# EAGLE schematic untitled (EAGLE 9.6.1)
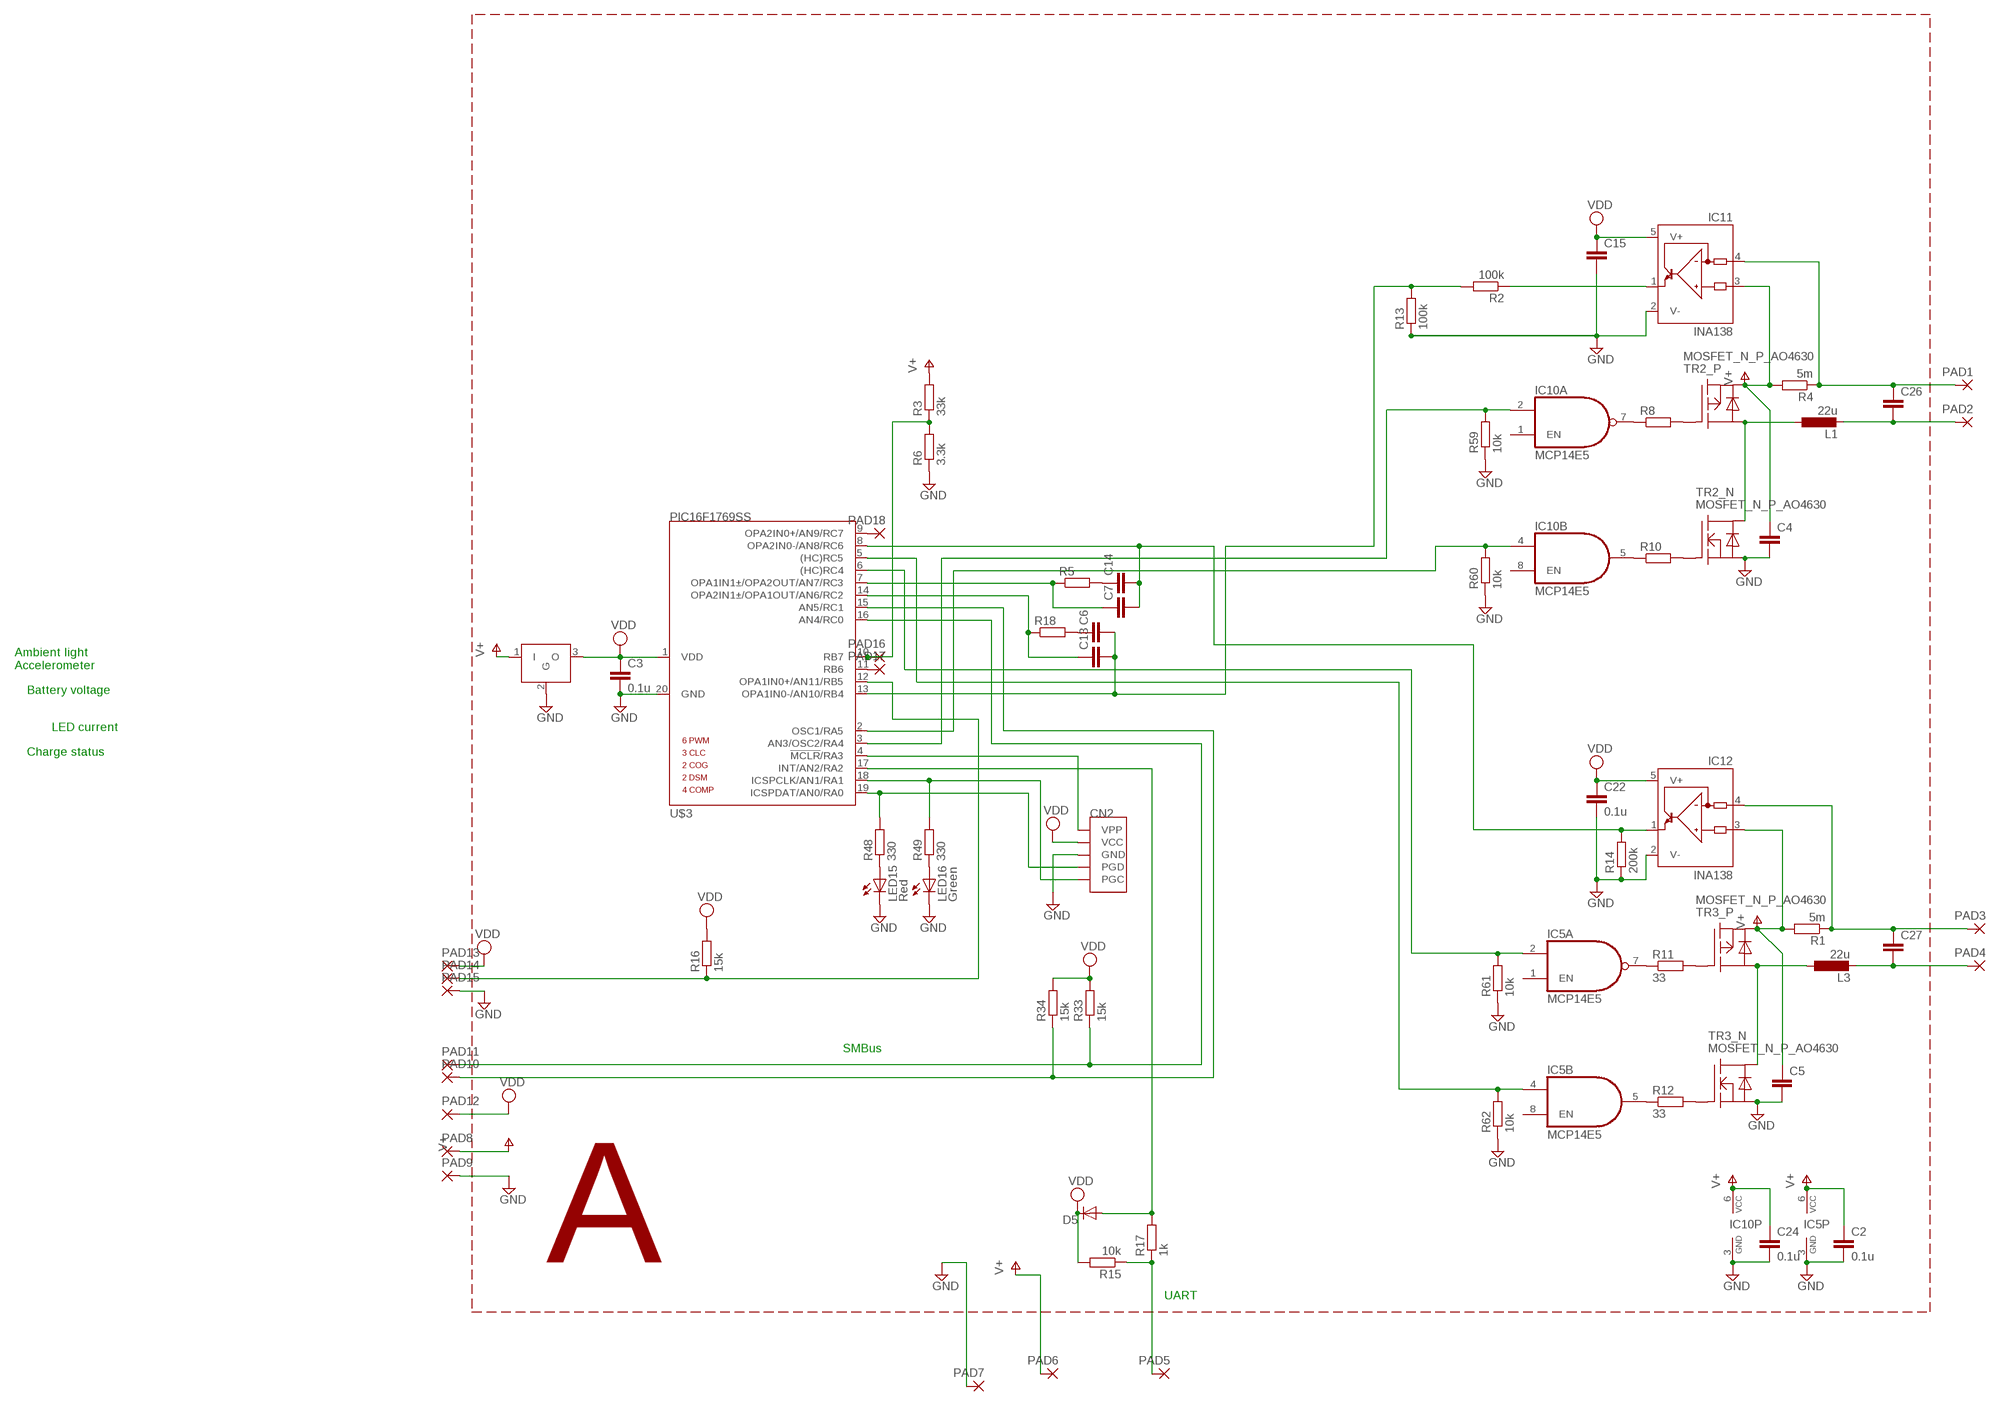
[diagram p0: schematic, sheet 1]

## Parts
C2  0.1u  C-EUC0402  [C0402]
C3  0.1u  C-EUC0402  [C0402]
C4  C-EUC0805  [C0805]
C5  C-EUC0805  [C0805]
C6  C-EUC0402  [C0402]
C7  C-EUC0402  [C0402]
C13  C-EUC0402  [C0402]
C14  C-EUC0402  [C0402]
C15  C-EUC0402  [C0402]
C22  0.1u  C-EUC0402  [C0402]
C24  0.1u  C-EUC0402  [C0402]
C26  C-EUC0805  [C0805]
C27  C-EUC0805  [C0805]
CN2  ICSP  [MINI-ICSP]
D5  DIODE-VMN2  [VMN2]
IC5  MCP14E5  [SO-08]
IC10  MCP14E5  [SO-08]
IC11  INA138  [SOT23-5]
IC12  INA138  [SOT23-5]
L1  22u  L-EUSCRH125  [SCRH125]
L3  22u  L-EUSCRH125  [SCRH125]
LED15  Red  LED1005  [CHIP-LED1005]
LED16  Green  LED1005  [CHIP-LED1005]
PAD1  1,6/0,8  [1,6/0,8]
PAD2  1,6/0,8  [1,6/0,8]
PAD3  1,6/0,8  [1,6/0,8]
PAD4  1,6/0,8  [1,6/0,8]
PAD5  1,6/0,8  [1,6/0,8]
PAD6  1,6/0,8  [1,6/0,8]
PAD7  1,6/0,8  [1,6/0,8]
PAD8  1,6/0,8  [1,6/0,8]
PAD9  1,6/0,8  [1,6/0,8]
PAD10  1,6/0,8  [1,6/0,8]
PAD11  1,6/0,8  [1,6/0,8]
PAD12  1,6/0,8  [1,6/0,8]
PAD13  1,6/0,8  [1,6/0,8]
PAD14  1,6/0,8  [1,6/0,8]
PAD15  1,6/0,8  [1,6/0,8]
PAD16  1,6/0,8  [1,6/0,8]
PAD17  1,6/0,8  [1,6/0,8]
PAD18  1,6/0,8  [1,6/0,8]
R1  5m  R-EU_R1210  [R1210]
R2  100k  R-EU_R0402  [R0402]
R3  33k  R-EU_R0402  [R0402]
R4  5m  R-EU_R1210  [R1210]
R5  R-EU_R0402  [R0402]
R6  3.3k  R-EU_R0402  [R0402]
R8  R-EU_R0402  [R0402]
R10  R-EU_R0402  [R0402]
R11  33  R-EU_R0402  [R0402]
R12  33  R-EU_R0402  [R0402]
R13  100k  R-EU_R0402  [R0402]
R14  200k  R-EU_R0402  [R0402]
R15  10k  R-EU_R0402  [R0402]
R16  15k  R-EU_R0402  [R0402]
R17  1k  R-EU_R0402  [R0402]
R18  R-EU_R0402  [R0402]
R33  15k  R-EU_R0402  [R0402]
R34  15k  R-EU_R0402  [R0402]
R48  330  R-EU_R0402  [R0402]
R49  330  R-EU_R0402  [R0402]
R59  10k  R-EU_R0402  [R0402]
R60  10k  R-EU_R0402  [R0402]
R61  10k  R-EU_R0402  [R0402]
R62  10k  R-EU_R0402  [R0402]
TR2  MOSFET_N_P_AO4630  [SO-08]
TR3  MOSFET_N_P_AO4630  [SO-08]
U$2  78-DC/DCV  [VXO78-500]
U$3  PIC16F1769SS  [SSOP20]

## Nets
GND: C2.2 C3.2 C4.2 C5.2 C15.2 C22.2 C24.2 CN2.GND IC5.3(P:GND) IC10.3(P:GND) IC11.2(V-) IC12.2(V-) LED15.C LED16.C PAD7.1(P) PAD9.1(P) PAD15.1(P) R6.1 R13.1 R14.1 R59.1 R60.1 R61.1 R62.1 TR2.1(_N:S) TR3.1(_N:S) U$2.2(G) U$3.20(GND)
N$1: IC11.1(OUT) R2.1
N$3: CN2.VPP U$3.4(!MCLR!/RA3)
N$4: PAD16.1(P) R3.1 R6.2 U$3.10(RB7)
N$5: IC5.4(B:I) R62.2 U$3.5((HC)RC5)
N$6: C26.1 IC11.4(IN-) PAD1.1(P) R4.1
N$8: IC10.2(A:I) R59.2 U$3.3(AN3/OSC2/RA4)
N$9: C26.2 L1.2 PAD2.1(P)
N$12: IC10.4(B:I) R60.2 U$3.2(OSC1/RA5)
N$14: CN2.PGD R48.2 U$3.19(ICSPDAT/AN0/RA0)
N$15: IC5.2(A:I) R61.2 U$3.6((HC)RC4)
N$16: CN2.PGC R49.2 U$3.18(ICSPCLK/AN1/RA1)
N$19: C6.2 C13.2 R2.2 R13.2 U$3.13(OPA1IN0-/AN10/RB4)
N$20: C7.2 C14.2 IC12.1(OUT) R14.2 U$3.8(OPA2IN0-/AN8/RC6)
N$21: PAD17.1(P) U$3.11(RB6)
N$22: PAD18.1(P) U$3.9(OPA2IN0+/AN9/RC7)
N$23: PAD14.1(P) R16.1 U$3.12(OPA1IN0+/AN11/RB5)
N$24: C14.1 R5.2
N$26: L3.1 TR3.5(_P:D) TR3.6(_P:D) TR3.7(_N:D) TR3.8(_N:D)
N$31: D5.A R17.2 U$3.17(INT/AN2/RA2)
N$32: R10.2 TR2.2(_N:G)
N$33: C27.2 L3.2 PAD4.1(P)
N$36: C13.1 R18.1 U$3.14(OPA2IN1±/OPA1OUT/AN6/RC2)
N$37: L1.1 TR2.5(_P:D) TR2.6(_P:D) TR2.7(_N:D) TR2.8(_N:D)
N$38: R11.2 TR3.4(_P:G)
N$42: R12.2 TR3.2(_N:G)
N$55: R8.2 TR2.4(_P:G)
N$57: PAD5.1(P) R15.1 R17.1
N$70: PAD10.1(P) R34.1 U$3.15(AN5/RC1)
N$71: PAD11.1(P) R33.1 U$3.16(AN4/RC0)
N$73: IC10.7(A:~O) R8.1
N$79: C27.1 IC12.4(IN-) PAD3.1(P) R1.1
N$80: IC5.7(A:~O) R11.1
N$89: C6.1 R18.2
N$90: C7.1 R5.1 U$3.7(OPA1IN1±/OPA2OUT/AN7/RC3)
N$103: LED15.A R48.1
N$104: LED16.A R49.1
N$115: IC10.5(B:O) R10.1
N$116: IC5.5(B:O) R12.1
V+: C2.1 C4.1 C5.1 C24.1 IC5.6(P:VCC) IC10.6(P:VCC) IC11.3(IN+) IC12.3(IN+) PAD6.1(P) PAD8.1(P) R1.2 R3.2 R4.2 TR2.3(_P:S) TR3.3(_P:S) U$2.1(I)
VDD: C3.1 C15.1 C22.1 CN2.VCC D5.C IC11.5(V+) IC12.5(V+) PAD12.1(P) PAD13.1(P) R15.2 R16.2 R33.2 R34.2 U$2.3(O) U$3.1(VDD)
Unconnected: IC5.1(A:EN) IC5.8(B:EN) IC10.1(A:EN) IC10.8(B:EN)

## Notes on the sheet
- Ambient light
  Accelerometer
- Battery voltage
- LED current
- Charge status
- SMBus
- A
- UART

## Library data of the parts
C2-C7 C13-C15 C22 C24 C26 C27 = rcl:C-EU: CAPACITOR, European symbol; SPICEPREFIX: C
CN2 = 0 my parts:ICSP
D5 = 5 D:DIODE-: DIODE
IC5 IC10 = 0 my parts:MCP14E5
IC11 IC12 = burr-brown:INA138: High-Side Measurement Current Shunt Monitor; MF: TEXAS INSTRUMENTS; MPN: INA138NA/250; OC_FARNELL: 1564888; OC_NEWARK: 80K5906
L1 L3 = 2 RCL:L-EU: INDUCTOR, European symbol
LED15 LED16 = 0 my parts:LED: LED OSRAM: - CHIPLED LG R971, LG N971, LY N971, LG Q971, LY Q971, LO R971, LY R971 LH N974, LH R974 LS Q976, LO Q976, LY Q976 LO Q996 - Hyper CHIPLED LW Q18S LB Q993, LB Q99A, LB R99A - SideLED LS A670, LO A670, LY A670, LG A670, LP A670 LB A673, LV A673, LT A673, LW A673 LH A674 LY A675 LS A676, LA A676, LO A676, LY A676, LW A676 LS A679, LY A679, LG A679 - Hyper Micro SIDELED® LS Y876, LA Y876, LO Y876, LY Y876 LT Y87S - SmartLED LW L88C, LW L88S LB L89C, LB L89S, LG L890 LS L89K, LO L89K, LY L89K LS L896, LA L896, LO L896, LY L896 - TOPLED LS T670, LO T670, LY T670, LG T670, LP T670 LSG T670, LSP T670, LSY T670, LOP T670, LYG T670 LG T671, LOG T671, LSG T671 LB T673, LV T673, LT T673, LW T673 LH T674 LS T676, LA T676, LO T676, LY T676, LB T676, LH T676, LSB T676, LW T676 LB T67C, LV T67C, LT T67C, LS T67K, LO T67K, LY T67K, LW E67C LS E67B, LA E67B, LO E67B, LY E67B, LB E67C, LV E67C, LT E67C LW T67C LS T679, LY T679, LG T679 LS T770, LO T770, LY T770, LG T770, LP T770 LB T773, LV T773, LT T773, LW T773 LH T774 LS E675, LA E675, LY E675, LS T675 LS T776, LA T776, LO T776, LY T776, LB T776 LHGB T686 LT T68C, LB T68C - Hyper Mini TOPLED® LB M676 - Mini TOPLED Santana® LG M470 LS M47K, LO M47K, LY M47K Source: http://www.osram.convergy.de - LUMILED® LXK2-PW12-R00, LXK2-PW12-S00, LXK2-PW14-U00, LXK2-PW14-V00 LXK2-PM12-R00, LXK2-PM12-S00, LXK2-PM14-U00 LXK2-PE12-Q00, LXK2-PE12-R00, LXK2-PE12-S00, LXK2-PE14-T00, LXK2-PE14-U00 LXK2-PB12-K00, LXK2-PB12-L00, LXK2-PB12-M00, LXK2-PB14-N00, LXK2-PB14-P00, LXK2-PB14-Q00 LXK2-PR12-L00, LXK2-PR12-M00, LXK2-PR14-Q00, LXK2-PR14-R00 LXK2-PD12-Q00, LXK2-PD12-R00, LXK2-PD12-S00 LXK2-PH12-R00, LXK2-PH12-S00 LXK2-PL12-P00, LXK2-PL12-Q00, LXK2-PL12-R00 Source: www.luxeon.com
PAD1-PAD18 = 4 PAD:1,6/0,8: THROUGH-HOLE PAD
R1-R6 R8 R10-R18 R33 R34 R48 R49 R59-R62 = rcl:R-EU_: RESISTOR, European symbol; SPICEPREFIX: R
TR2 TR3 = 0 my parts:MOSFET_N_P
U$2 = 0 my parts:78-DC/DC
U$3 = 0 my parts:PIC16F1769